# EAGLE design SparkFun_ACS712_Breakout_v11 (EAGLE 6.1)
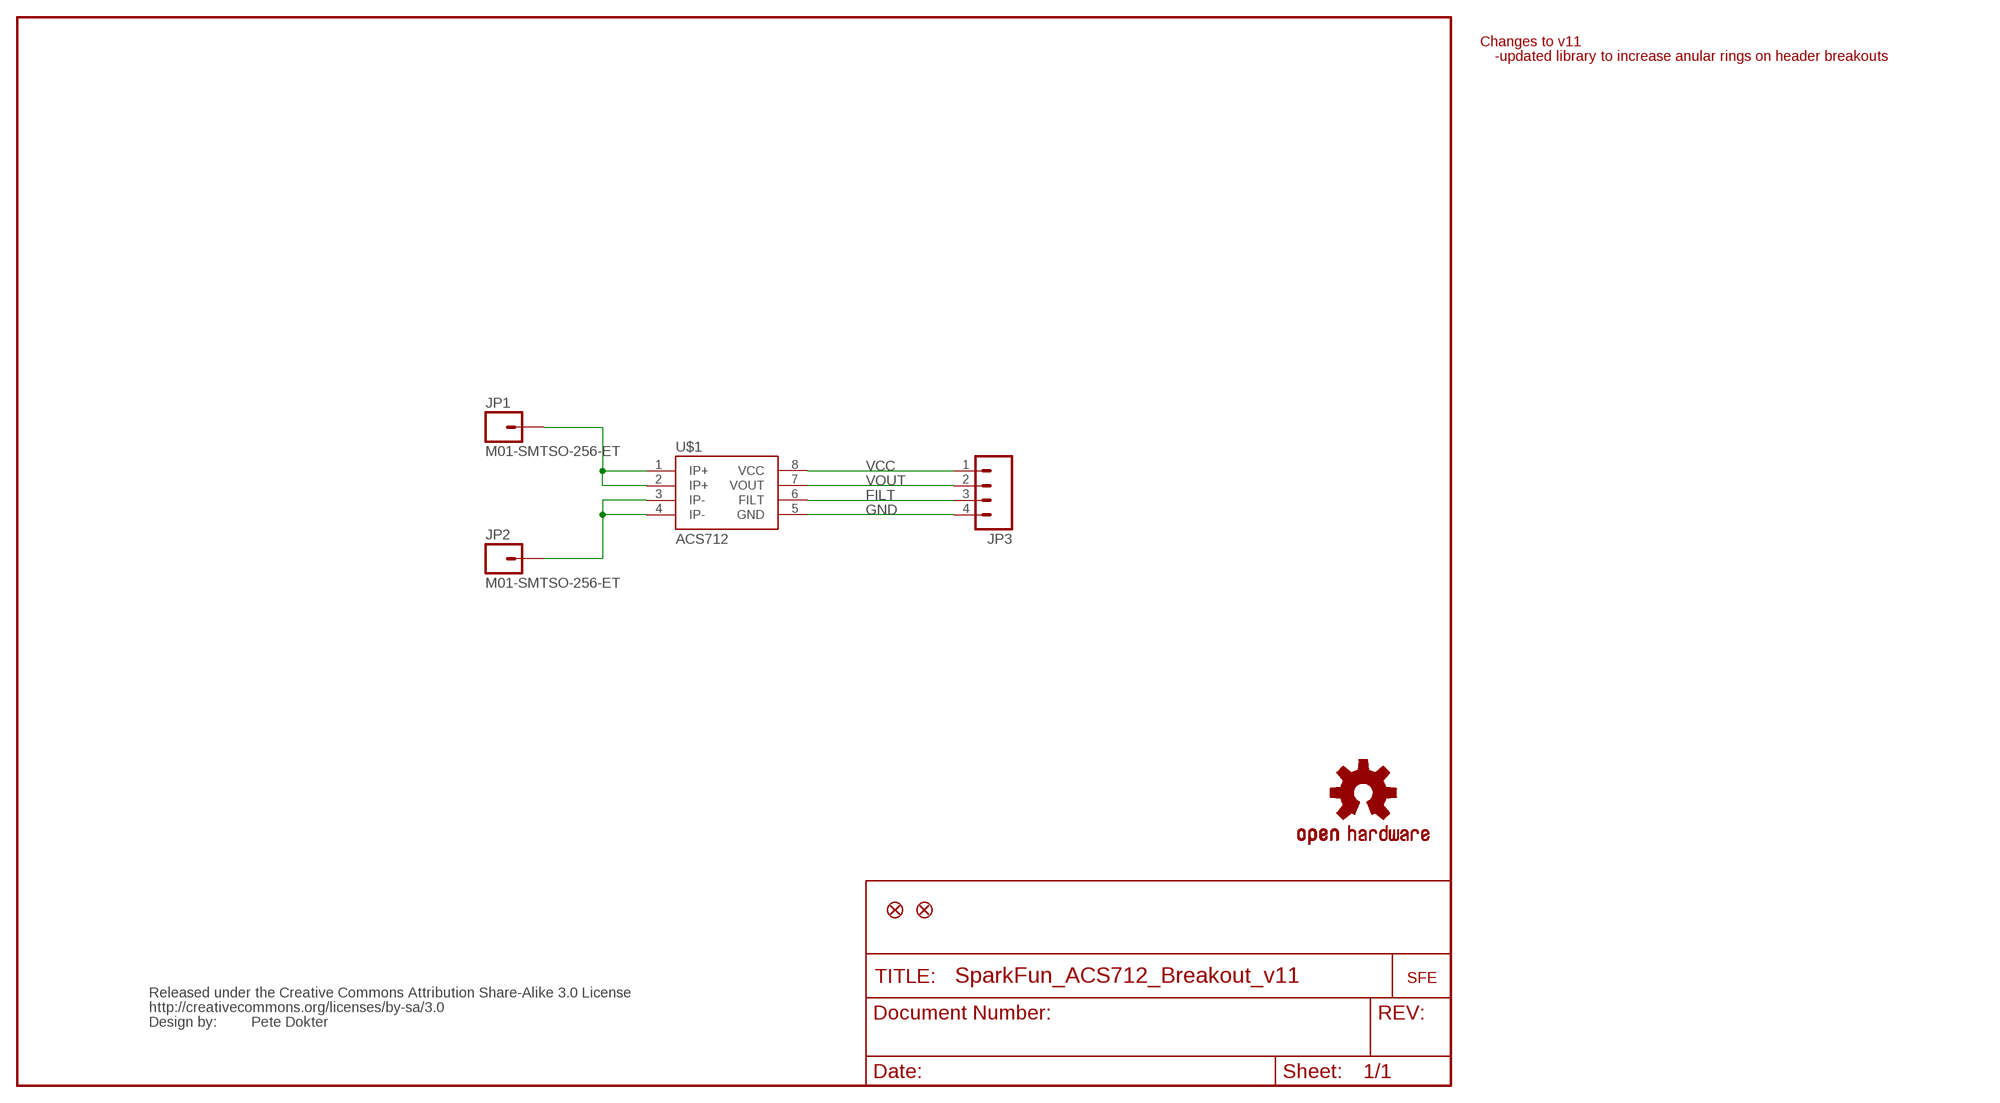
[diagram p0: schematic, sheet 1]

## Parts
JP1  M01-SMTSO-256-ET  [SMTSO-256-ET]
JP2  M01-SMTSO-256-ET  [SMTSO-256-ET]
JP3  M04PTH  [1X04]
JP4  FIDUCIALUFIDUCIAL  [MICRO-FIDUCIAL]
JP5  FIDUCIALUFIDUCIAL  [MICRO-FIDUCIAL]
U$1  ACS712  [SO08]
U$2  LOGO-FLAME-LARGE  [LOGO-FLAME-LARGE]
U$3  OSHW-LOGOS  [OSHW-LOGO-S]
U$4  CREATIVE_COMMONS  [CREATIVE_COMMONS]

## Nets
FILT: JP3.3 U$1.6(FILT)
GND: JP3.4 U$1.5(GND)
N$1: JP1.P$1 U$1.1(IP+) U$1.2(IP+)
N$3: JP2.P$1 U$1.3(IP-) U$1.4(IP-)
VCC: JP3.1 U$1.8(VCC)
VOUT: JP3.2 U$1.7(VOUT)

## Notes on the sheet
- Changes to v11
- -updated library to increase anular rings on header breakouts
- Pete Dokter

## Library data of the parts
JP1 JP2 = SparkFun:M01: Header 1 Standard 1-pin 0.1" header. Use with straight break away headers (SKU : PRT-00116), right angle break away headers (PRT-00553), swiss pins (PRT-00743), machine pins (PRT-00117), and female headers (PRT-00115).
JP3 = SparkFun:M04: Header 4 Standard 4-pin 0.1" header. Use with straight break away headers (SKU : PRT-00116), right angle break away headers (PRT-00553), swiss pins (PRT-00743), machine pins (PRT-00117), and female headers (PRT-00115). Molex polarized connector foot print use with SKU : PRT-08231 with associated crimp pins and housings. 1MM SMD Version SKU: PRT-10208
JP4 JP5 = SparkFun:FIDUCIAL: Fiducial Alignment Points Various fiducial points for machine vision alignment.
U$1 = SparkFun:ACS712
U$2 = SparkFun:LOGO-FLAME-LARGE
U$3 = SparkFun:OSHW-LOGO: Open Source Hardware Logo This logo indicates the piece of hardware it is found on incorporates a OSHW license and/or adheres to the definition of open source hardware found here: http://freedomdefined.org/OSHW
U$4 = SparkFun:CREATIVE_COMMONS

## Board
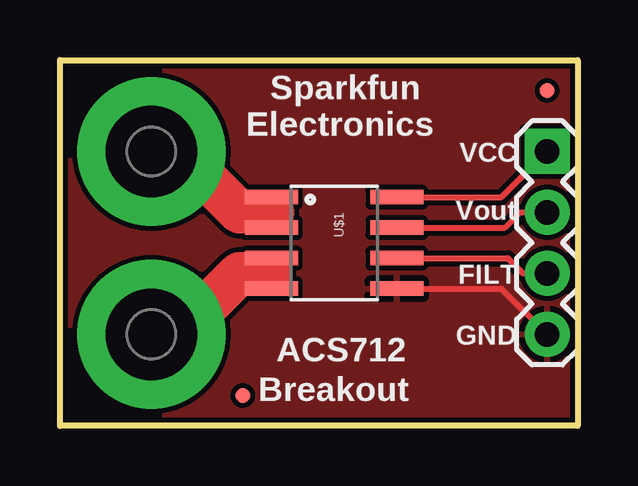
[diagram p1: board, top side]
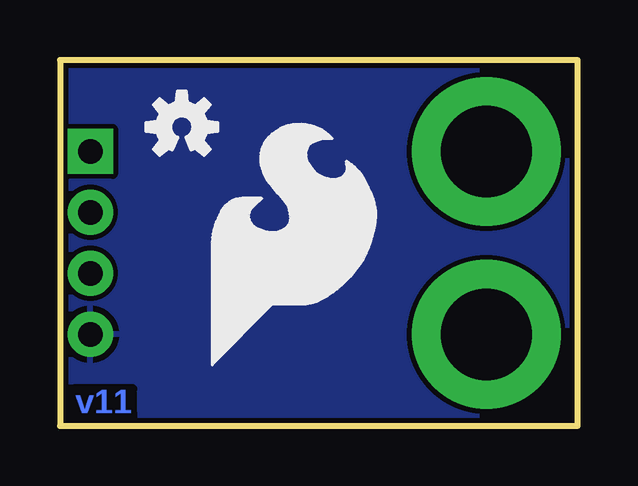
[diagram p2: board, bottom side, seen from below]

Size 21.59 x 15.24 mm. Coordinates in mm from the lower left corner, seen from the top.
Outline: 0,0 0,15.24 21.59,15.24 21.59,0 0,0
Copper layers (1*16): Top 0.035mm / dielectric 1.5mm / Bottom 0.035mm
Design rules: minimum track width 8mil, minimum drill 20mil, track to track 8mil, track to pad 8mil, pad to pad 8mil, via to via 8mil, smd to smd 8mil, copper to edge 8mil, drill to drill 8mil, minimum pad ring 12mil, minimum via ring 10mil, stop-mask expansion 4mil, vias tented up to drill 20mil, thermal gap 10mil

### Footprints (pad centres in the part's own frame; a part is rotated, then mirrored left to right if it is on the bottom)
SMTSO-256-ET = drill 3.81 pad 6.198: P$1 0,0
1X04 = drill 1.016 pad 1.88 square: 1 0,0 | drill 1.016 pad 1.88: 2 2.54,0; 3 5.08,0; 4 7.62,0
MICRO-FIDUCIAL = smd 0.635 x 0.635: 1 0,0
SO08 = smd 0.61 x 2.21: 1 -1.905,-2.616; 2 -0.635,-2.616; 3 0.635,-2.616; 4 1.905,-2.616; 5 1.905,2.616; 6 0.635,2.616; 7 -0.635,2.616; 8 -1.905,2.616

### Placement (x,y rotation side)
JP1  3.81,11.43 0 top
JP2  3.81,3.81 0 top
JP3  20.32,11.43 270 top
JP4  20.32,13.97 0 top
JP5  7.62,1.27 0 top
U$1  11.43,7.62 270 top
U$2  15.24,2.54 0 bottom
U$3  16.51,12.45 0 bottom
U$4  21.59,-7.62 0 top  (outside the outline)

### Tracks (layer width: path | path; a pad name or v marks a point on that pad's centre or on a via)
FILT
  Top 0.254: JP3.3 19.3,6.35 18.67,6.99 U$1.6
GND
  Top 0.254: U$1.5 18.41,5.71 JP3.4
  pour Bottom: 0,0 21.59,0 21.59,15.24 0,15.24
  pour Top: 0,0 21.59,0 21.59,15.24 0,15.24
N$1
  Top 0.254: U$1.1 8.81,8.97 8.89,8.89 8.81,8.81 U$1.2
  Top 1.778: JP1.P$1 4.95,11.43 7.49,8.89 8.89,8.89
N$3
  Top 0.254: U$1.4 8.81,6.3 8.76,6.35 8.81,6.4 U$1.3
  Top 1.778: JP2.P$1 4.95,3.81 7.49,6.35 8.76,6.35
VCC
  Top 0.254: U$1.8 18.41,9.53 JP3.1
VOUT
  Top 0.254: JP3.2 19.18,8.89 18.54,8.26 U$1.7 13.97,8.26

### Text on the board
Bottom: v11
tPlace: Sparkfun | Electronics | VCC | Vout | FILT | GND | ACS712 | Breakout